# Altium schematic sheet SCH-1.SchDoc
size A4; Date: 05.05.2020; Organization: Günsel Model 1 Body Harness; Revision: v0.2
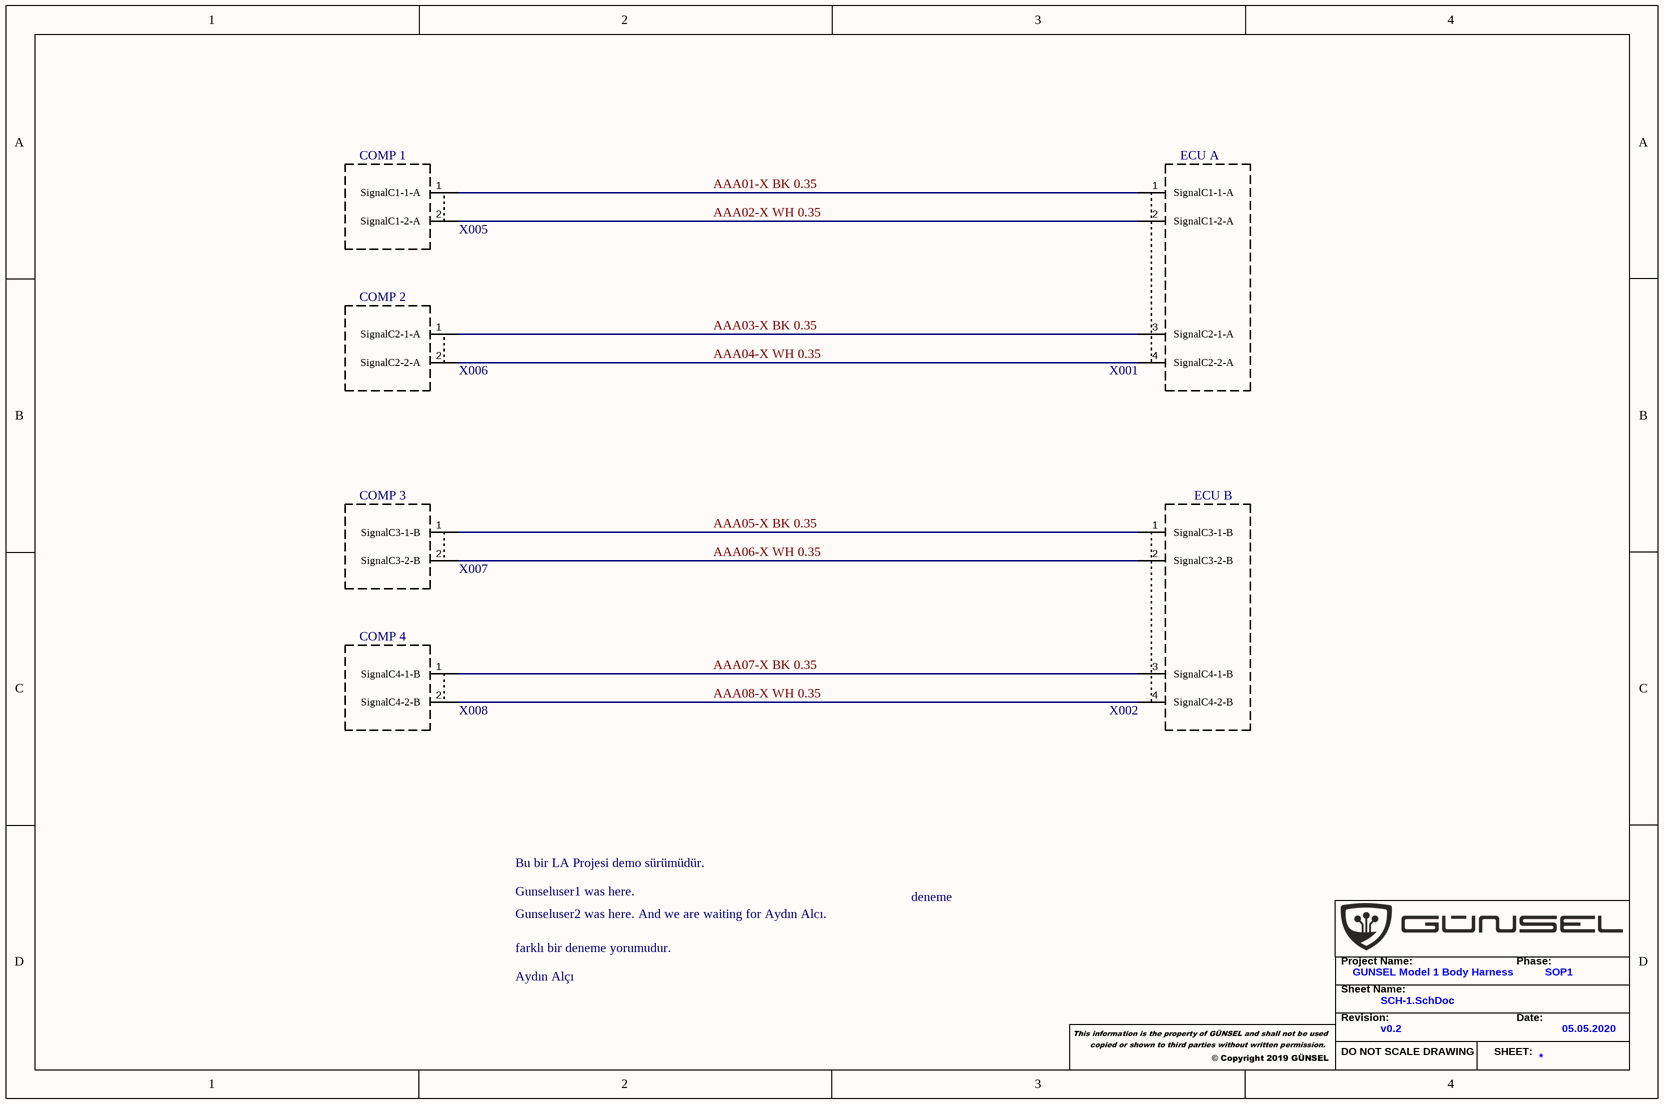
[diagram p0: SCH-1.SchDoc]

## Parts
X1  X001
X2  X005
X3  X006
X4  X002
X5  X007
X6  X008

## Blocks framed on the sheet
ECU A: X1
ECU B: X4

## Nets
AAA01-X BK 0.35: X1.1(SignalC1-1-A) X2.1(SignalC1-1-A)
AAA02-X WH 0.35: X1.2(SignalC1-2-A) X2.2(SignalC1-2-A)
AAA03-X BK 0.35: X1.3(SignalC2-1-A) X3.1(SignalC2-1-A)
AAA04-X WH 0.35: X1.4(SignalC2-2-A) X3.2(SignalC2-2-A)
AAA05-X BK 0.35: X4.1(SignalC3-1-B) X5.1(SignalC3-1-B)
AAA06-X WH 0.35: X4.2(SignalC3-2-B) X5.2(SignalC3-2-B)
AAA07-X BK 0.35: X4.3(SignalC4-1-B) X6.1(SignalC4-1-B)
AAA08-X WH 0.35: X4.4(SignalC4-2-B) X6.2(SignalC4-2-B)

Not connected (* = marked no-connect by the designer): X1 5 6 7 8 9 10 11 12 13 14 15 16 17 18 19 20; X2 3 4 5; X3 3(SHT-CRC-1) 4 5; X4 5 6 7 8 9 10 11 12 13 14 15 16 17 18 19 20; X5 3 4 5; X6 3(SHT-CRC-2) 4(SHT-CRC-3) 5(SHT-CRC-4)

## Notes on the sheet
- (near X2) COMP 1
- (near X3) COMP 2
- (near X5) COMP 3
- (near X6) COMP 4
- Bu bir LA Projesi demo sürümüdür.
- Gunseluser1 was here.
- deneme
- Gunseluser2 was here. And we are waiting for Aydın Alcı.
- farklı bir deneme yorumudur.
- Aydın Alçı
- Project Name:
- GUNSEL Model 1 Body Harness
- Phase:
- SOP1
- Sheet Name:
- Revision:
- DO NOT SCALE DRAWING
- SHEET:
- Date:

## Library data of the parts
X1 = ECU A: Designator_: X001; Pin count: 20; Manufacturer Part number: E-1
X2 = COMP 1: Designator_: X005; Pin count: 5; Manufacturer Part number: C-1
X3 = COMP2: Designator_: X006; Pin count: 5; Manufacturer Part number: C-2
X4 = ECU B: Designator_: X002; Pin count: 20; Manufacturer Part number: E-2
X5 = COMP 3: Designator_: X007; Pin count: 5; Manufacturer Part number: C-3
X6 = COMP 4: Designator_: X008; Pin count: 5; Manufacturer Part number: C-4